# EAGLE schematic motiondetector (EAGLE 7.3.0)
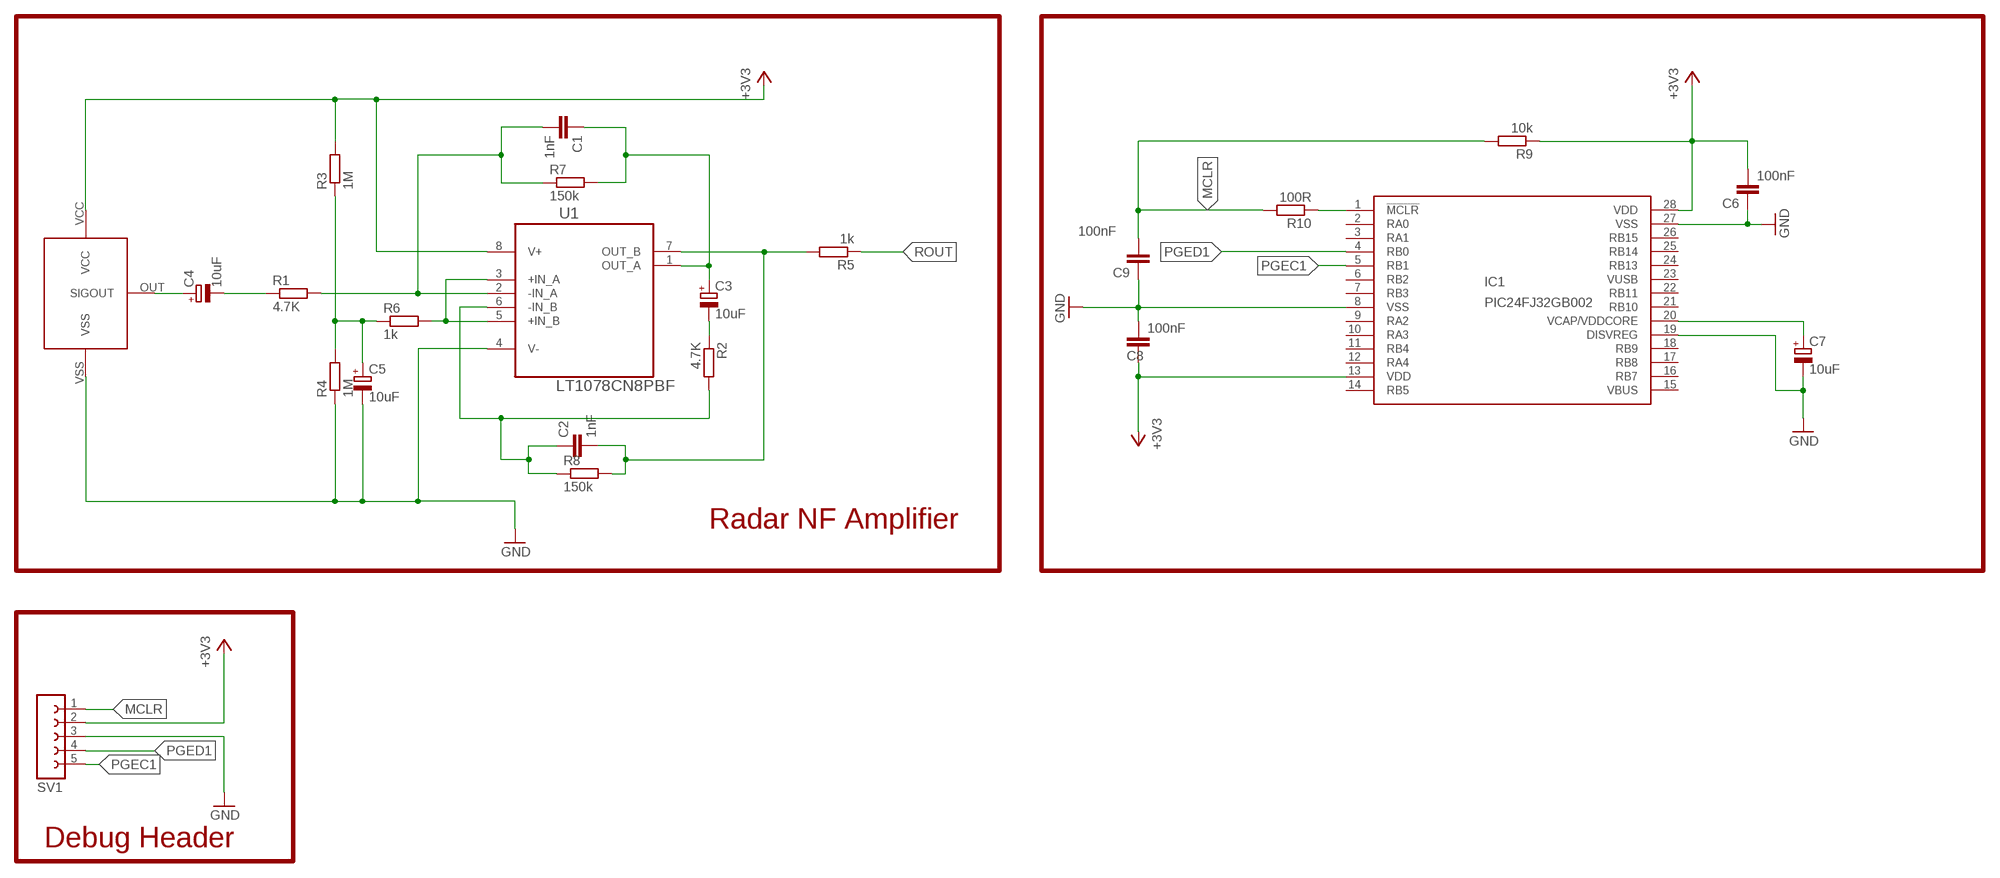
[diagram p0: schematic, sheet 1]

## Parts
C1  1nF  C-EU025-025X050  [C025-025X050]
C2  1nF  C-EU025-025X050  [C025-025X050]
C3  10uF  CPOL-EUE2.5-5  [E2,5-5]
C4  10uF  CPOL-EUE2.5-5  [E2,5-5]
C5  10uF  CPOL-EUE2.5-5  [E2,5-5]
C6  100nF  C-EU025-025X050  [C025-025X050]
C7  10uF  CPOL-EUE2.5-5  [E2,5-5]
C8  100nF  C-EU025-025X050  [C025-025X050]
C9  100nF  C-EU025-025X050  [C025-025X050]
IC1  PIC24FJ32GB002  [DIL28-3]
R1  4.7K  R-EU_0207/10  [0207/10]
R2  4.7K  R-EU_0207/10  [0207/10]
R3  1M  R-EU_0207/10  [0207/10]
R4  1M  R-EU_0207/10  [0207/10]
R5  1k  R-EU_0207/10  [0207/10]
R6  1k  R-EU_0207/10  [0207/10]
R7  150k  R-EU_0207/10  [0207/10]
R8  150k  R-EU_0207/10  [0207/10]
R9  10k  R-EU_0207/10  [0207/10]
R10  100R  R-EU_0207/10  [0207/10]
SV1  FE05-1  [FE05-1]
U1  LT1078CN8PBF  [DIP254P762X393-8]
U$1  RSM3650  [RSM3650]

## Nets
+3V3: C6.2 C8.1 IC1.13(VDD) IC1.28(VDD) R3.2 R9.1 SV1.2 U1.8(V+) U$1.VCC
GND: C5.- C6.1 C7.- C8.2 C9.1 IC1.8(VSS) IC1.19(DISVREG) IC1.27(VSS) R4.1 SV1.3 U1.4(V-) U$1.VSS
MCLR: C9.2 R9.2 R10.2 SV1.1
N$1: C4.- R1.1
N$2: C1.2 R1.2 R7.1 U1.2(-IN_A)
N$3: C4.+ U$1.OUT(SIGOUT)
N$4: C3.- R2.1
N$6: R6.2 U1.3(+IN_A) U1.5(+IN_B)
N$7: C5.+ R3.1 R4.2 R6.1
N$8: C2.2 R5.2 R8.2 U1.7(OUT_B)
N$9: C1.1 C3.+ R7.2 U1.1(OUT_A)
N$11: C2.1 R2.2 R8.1 U1.6(-IN_B)
N$12: C7.+ IC1.20(VCAP/VDDCORE)
N$13: IC1.1(!MCLR) R10.1
PGEC1: IC1.5(RB1) SV1.5
PGED1: IC1.4(RB0) SV1.4
ROUT: R5.1
Unconnected: IC1.2(RA0) IC1.3(RA1) IC1.6(RB2) IC1.7(RB3) IC1.9(RA2) IC1.10(RA3) IC1.11(RB4) IC1.12(RA4) IC1.14(RB5) IC1.15(VBUS) IC1.16(RB7) IC1.17(RB8) IC1.18(RB9) IC1.21(RB10) IC1.22(RB11) IC1.23(VUSB) IC1.24(RB13) IC1.25(RB14) IC1.26(RB15)

## Notes on the sheet
- Radar NF Amplifier
- Debug Header

## Library data of the parts
C1 C2 C6 C8 C9 = parts:C-EU: CAPACITOR, European symbol
C3-C5 C7 = parts:CPOL-EU: POLARIZED CAPACITOR, European symbol
IC1 = PIC24FJXXGB0XX :PIC24FJ32GB002: PIC24FJ32GB002 edit this description DIL 28-3 Package
R1-R10 = parts:R-EU_: RESISTOR, European symbol
SV1 = con-lsta:FE05-1: FEMALE HEADER; OC_FARNELL: unknown; OC_NEWARK: unknown
U1 = parts:LT1078CN8PBF: Op Amp; MPN: LT1078CN8#PBF; OC_FARNELL: 9559680; OC_NEWARK: 57M1404; PACKAGE: PDIP; SUPPLIER: LINEAR TECHNOLOGY
U$1 = RSM3650:RSM3650: Radar based motion detector module RSM3650